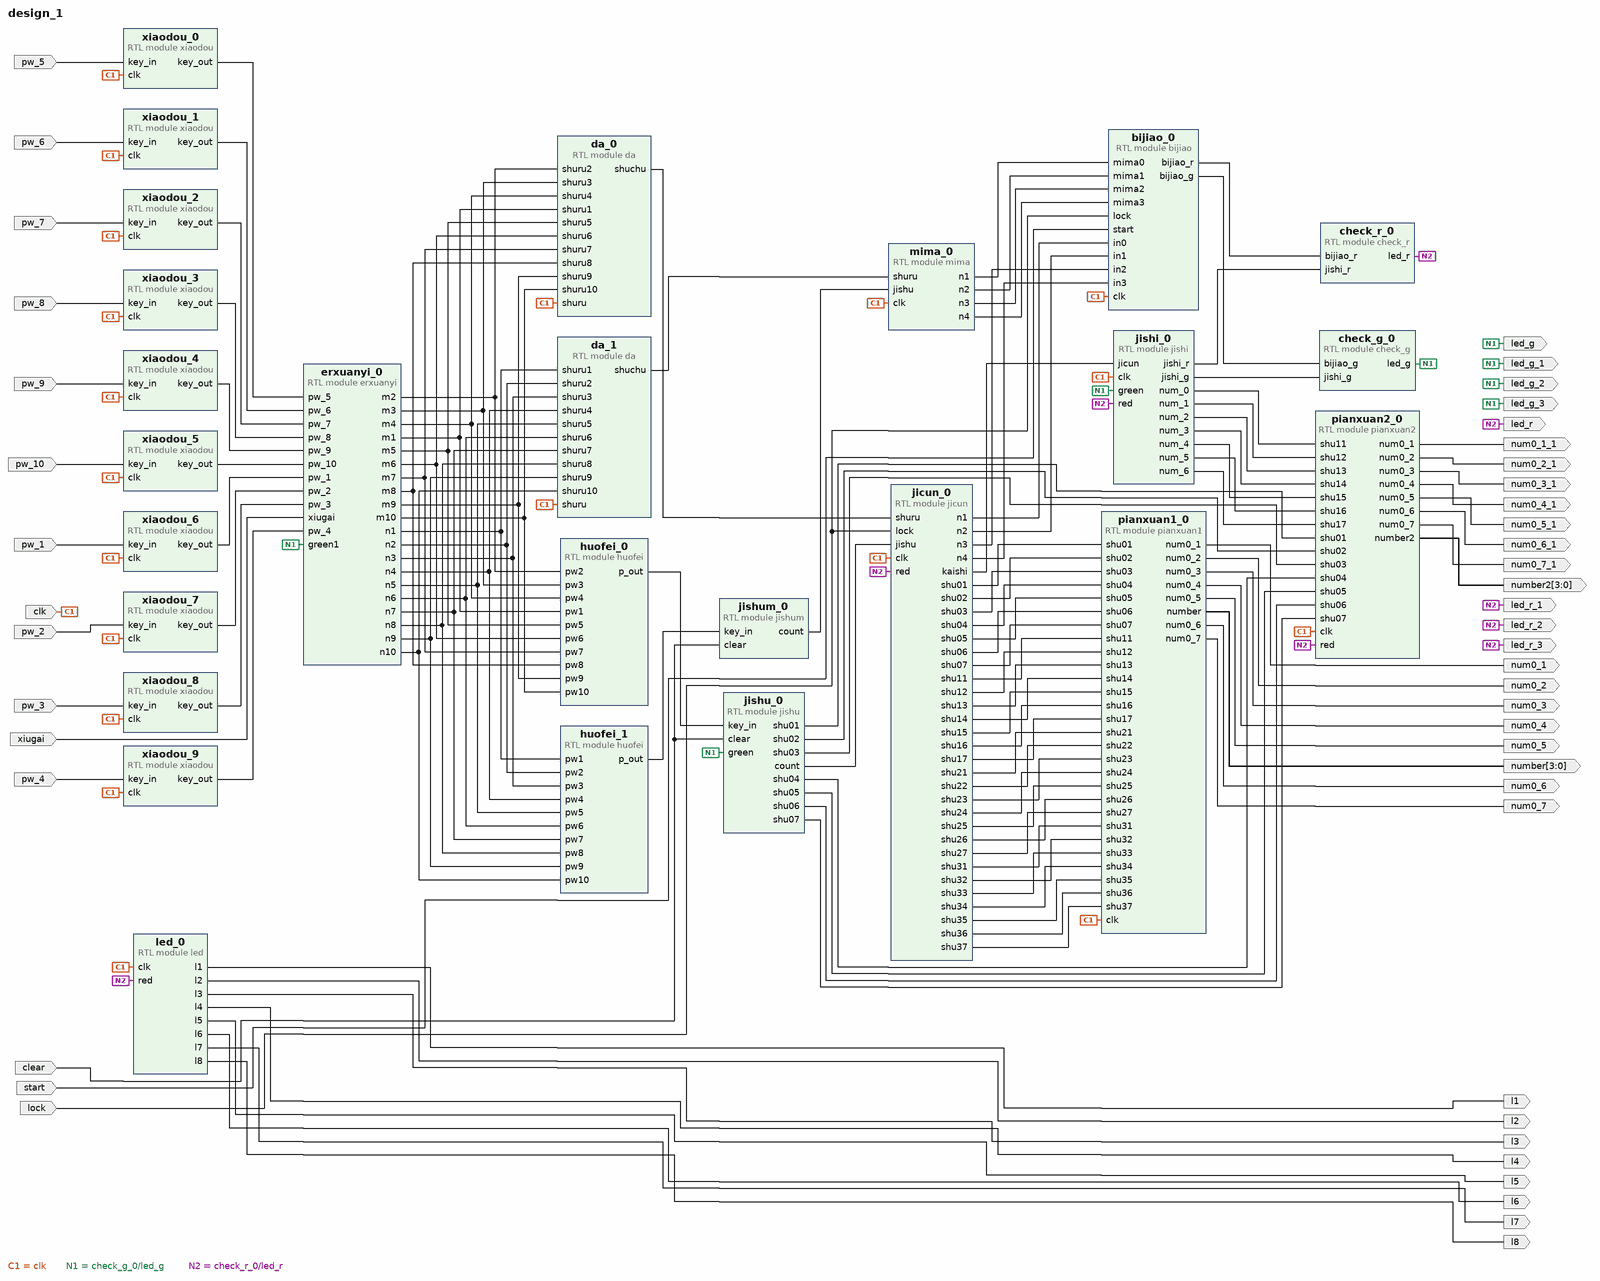
[diagram p0: block diagram of the top level]
# Vivado block design design_1, xc7a35tcsg324-3, Vivado 2017.4
create_bd_design design_1

create_bd_port -dir I pw_1
create_bd_port -dir I pw_2
create_bd_port -dir I pw_3
create_bd_port -dir I pw_4
create_bd_port -dir I xiugai
create_bd_port -dir I clear
create_bd_port -dir I -type clk clk
set_property -dict {CONFIG.FREQ_HZ 100000000} [get_bd_ports clk]
create_bd_port -dir I start
create_bd_port -dir I lock
create_bd_port -dir O led_g
create_bd_port -dir O led_g_1
create_bd_port -dir O led_g_2
create_bd_port -dir O led_g_3
create_bd_port -dir O led_r
create_bd_port -dir O led_r_1
create_bd_port -dir O led_r_2
create_bd_port -dir O led_r_3
create_bd_port -dir O -from 3 -to 0 number
create_bd_port -dir O num0_1
create_bd_port -dir O num0_2
create_bd_port -dir O num0_3
create_bd_port -dir O num0_4
create_bd_port -dir O num0_5
create_bd_port -dir O num0_6
create_bd_port -dir O num0_7
create_bd_port -dir O -from 3 -to 0 number2
create_bd_port -dir O num0_1_1
create_bd_port -dir O num0_2_1
create_bd_port -dir O num0_3_1
create_bd_port -dir O num0_4_1
create_bd_port -dir O num0_5_1
create_bd_port -dir O num0_6_1
create_bd_port -dir O num0_7_1
create_bd_port -dir O l1
create_bd_port -dir O l2
create_bd_port -dir O l3
create_bd_port -dir O l4
create_bd_port -dir O l5
create_bd_port -dir O l6
create_bd_port -dir O l7
create_bd_port -dir O l8
create_bd_port -dir I pw_5
create_bd_port -dir I pw_6
create_bd_port -dir I pw_7
create_bd_port -dir I pw_8
create_bd_port -dir I pw_9
create_bd_port -dir I pw_10

create_bd_cell -type module -reference jishum jishum_0
create_bd_cell -type module -reference check_g check_g_0
create_bd_cell -type module -reference check_r check_r_0
create_bd_cell -type module -reference pianxuan1 pianxuan1_0
create_bd_cell -type module -reference led led_0
create_bd_cell -type module -reference erxuanyi erxuanyi_0
create_bd_cell -type module -reference huofei huofei_0
create_bd_cell -type module -reference huofei huofei_1
create_bd_cell -type module -reference da da_0
create_bd_cell -type module -reference da da_1
create_bd_cell -type module -reference mima mima_0
create_bd_cell -type module -reference jishi jishi_0
create_bd_cell -type module -reference pianxuan2 pianxuan2_0
create_bd_cell -type module -reference bijiao bijiao_0
create_bd_cell -type module -reference jishu jishu_0
create_bd_cell -type module -reference jicun jicun_0
create_bd_cell -type module -reference xiaodou xiaodou_0
create_bd_cell -type module -reference xiaodou xiaodou_1
create_bd_cell -type module -reference xiaodou xiaodou_2
create_bd_cell -type module -reference xiaodou xiaodou_3
create_bd_cell -type module -reference xiaodou xiaodou_4
create_bd_cell -type module -reference xiaodou xiaodou_5
create_bd_cell -type module -reference xiaodou xiaodou_6
create_bd_cell -type module -reference xiaodou xiaodou_7
create_bd_cell -type module -reference xiaodou xiaodou_8
create_bd_cell -type module -reference xiaodou xiaodou_9

# ---- connections ----

connect_bd_net [get_bd_ports xiugai] [get_bd_pins erxuanyi_0/xiugai]
connect_bd_net [get_bd_pins erxuanyi_0/n1] [get_bd_pins huofei_1/pw1] [get_bd_pins da_1/shuru1]
connect_bd_net [get_bd_pins erxuanyi_0/n2] [get_bd_pins huofei_1/pw2] [get_bd_pins da_1/shuru2]
connect_bd_net [get_bd_pins erxuanyi_0/n3] [get_bd_pins huofei_1/pw3] [get_bd_pins da_1/shuru3]
connect_bd_net [get_bd_pins erxuanyi_0/n4] [get_bd_pins huofei_1/pw4] [get_bd_pins da_1/shuru4]
connect_bd_net [get_bd_pins erxuanyi_0/m2] [get_bd_pins huofei_0/pw2] [get_bd_pins da_0/shuru2]
connect_bd_net [get_bd_pins erxuanyi_0/m3] [get_bd_pins huofei_0/pw3] [get_bd_pins da_0/shuru3]
connect_bd_net [get_bd_pins erxuanyi_0/m4] [get_bd_pins huofei_0/pw4] [get_bd_pins da_0/shuru4]
connect_bd_net [get_bd_ports clear] [get_bd_pins jishum_0/clear] [get_bd_pins jishu_0/clear]
connect_bd_net [get_bd_pins huofei_0/p_out] [get_bd_pins jishu_0/key_in]
connect_bd_net [get_bd_pins erxuanyi_0/m1] [get_bd_pins huofei_0/pw1] [get_bd_pins da_0/shuru1]
connect_bd_net [get_bd_ports clk] \
  [get_bd_pins pianxuan1_0/clk] [get_bd_pins led_0/clk] [get_bd_pins da_0/shuru] [get_bd_pins da_1/shuru] \
  [get_bd_pins mima_0/clk] [get_bd_pins jishi_0/clk] [get_bd_pins pianxuan2_0/clk] [get_bd_pins bijiao_0/clk] \
  [get_bd_pins jicun_0/clk] [get_bd_pins xiaodou_0/clk] [get_bd_pins xiaodou_1/clk] [get_bd_pins xiaodou_2/clk] \
  [get_bd_pins xiaodou_3/clk] [get_bd_pins xiaodou_4/clk] [get_bd_pins xiaodou_5/clk] [get_bd_pins xiaodou_9/clk] \
  [get_bd_pins xiaodou_6/clk] [get_bd_pins xiaodou_7/clk] [get_bd_pins xiaodou_8/clk]
connect_bd_net [get_bd_pins da_0/shuchu] [get_bd_pins jicun_0/shuru]
connect_bd_net [get_bd_pins jishu_0/count] [get_bd_pins jicun_0/jishu]
connect_bd_net [get_bd_pins da_1/shuchu] [get_bd_pins mima_0/shuru]
connect_bd_net [get_bd_pins huofei_1/p_out] [get_bd_pins jishum_0/key_in]
connect_bd_net [get_bd_pins jishum_0/count] [get_bd_pins mima_0/jishu]
connect_bd_net [get_bd_pins mima_0/n1] [get_bd_pins bijiao_0/mima0]
connect_bd_net [get_bd_pins mima_0/n2] [get_bd_pins bijiao_0/mima1]
connect_bd_net [get_bd_pins mima_0/n3] [get_bd_pins bijiao_0/mima2]
connect_bd_net [get_bd_pins mima_0/n4] [get_bd_pins bijiao_0/mima3]
connect_bd_net [get_bd_pins jicun_0/n1] [get_bd_pins bijiao_0/in0]
connect_bd_net [get_bd_pins jicun_0/n2] [get_bd_pins bijiao_0/in1]
connect_bd_net [get_bd_pins jicun_0/n3] [get_bd_pins bijiao_0/in2]
connect_bd_net [get_bd_pins jicun_0/n4] [get_bd_pins bijiao_0/in3]
connect_bd_net [get_bd_ports start] [get_bd_pins bijiao_0/start]
connect_bd_net [get_bd_ports lock] [get_bd_pins bijiao_0/lock] [get_bd_pins jicun_0/lock]
connect_bd_net [get_bd_pins bijiao_0/bijiao_g] [get_bd_pins check_g_0/bijiao_g]
connect_bd_net [get_bd_pins bijiao_0/bijiao_r] [get_bd_pins check_r_0/bijiao_r]
connect_bd_net [get_bd_pins check_g_0/led_g] \
  [get_bd_ports led_g_3] [get_bd_ports led_g_2] [get_bd_ports led_g_1] [get_bd_ports led_g] [get_bd_pins erxuanyi_0/green1] \
  [get_bd_pins jishi_0/green] [get_bd_pins jishu_0/green]
connect_bd_net [get_bd_pins check_r_0/led_r] \
  [get_bd_ports led_r_3] [get_bd_ports led_r_2] [get_bd_ports led_r_1] [get_bd_ports led_r] [get_bd_pins led_0/red] \
  [get_bd_pins jishi_0/red] [get_bd_pins pianxuan2_0/red] [get_bd_pins jicun_0/red]
connect_bd_net [get_bd_pins jishi_0/jishi_g] [get_bd_pins check_g_0/jishi_g]
connect_bd_net [get_bd_pins jishi_0/jishi_r] [get_bd_pins check_r_0/jishi_r]
connect_bd_net -net jishu_0_kaishi [get_bd_pins jicun_0/kaishi] [get_bd_pins jishi_0/jicun]
connect_bd_net [get_bd_pins jicun_0/shu01] [get_bd_pins pianxuan1_0/shu01]
connect_bd_net [get_bd_pins jicun_0/shu02] [get_bd_pins pianxuan1_0/shu02]
connect_bd_net [get_bd_pins jicun_0/shu03] [get_bd_pins pianxuan1_0/shu03]
connect_bd_net [get_bd_pins jicun_0/shu04] [get_bd_pins pianxuan1_0/shu04]
connect_bd_net [get_bd_pins jicun_0/shu05] [get_bd_pins pianxuan1_0/shu05]
connect_bd_net [get_bd_pins jicun_0/shu06] [get_bd_pins pianxuan1_0/shu06]
connect_bd_net [get_bd_pins jicun_0/shu07] [get_bd_pins pianxuan1_0/shu07]
connect_bd_net [get_bd_pins jicun_0/shu11] [get_bd_pins pianxuan1_0/shu11]
connect_bd_net [get_bd_pins jicun_0/shu12] [get_bd_pins pianxuan1_0/shu12]
connect_bd_net [get_bd_pins jicun_0/shu13] [get_bd_pins pianxuan1_0/shu13]
connect_bd_net [get_bd_pins jicun_0/shu14] [get_bd_pins pianxuan1_0/shu14]
connect_bd_net [get_bd_pins jicun_0/shu15] [get_bd_pins pianxuan1_0/shu15]
connect_bd_net [get_bd_pins jicun_0/shu16] [get_bd_pins pianxuan1_0/shu16]
connect_bd_net [get_bd_pins jicun_0/shu17] [get_bd_pins pianxuan1_0/shu17]
connect_bd_net [get_bd_pins jicun_0/shu21] [get_bd_pins pianxuan1_0/shu21]
connect_bd_net [get_bd_pins jicun_0/shu22] [get_bd_pins pianxuan1_0/shu22]
connect_bd_net [get_bd_pins jicun_0/shu23] [get_bd_pins pianxuan1_0/shu23]
connect_bd_net [get_bd_pins jicun_0/shu24] [get_bd_pins pianxuan1_0/shu24]
connect_bd_net [get_bd_pins jicun_0/shu25] [get_bd_pins pianxuan1_0/shu25]
connect_bd_net [get_bd_pins jicun_0/shu26] [get_bd_pins pianxuan1_0/shu26]
connect_bd_net [get_bd_pins jicun_0/shu27] [get_bd_pins pianxuan1_0/shu27]
connect_bd_net [get_bd_pins jicun_0/shu31] [get_bd_pins pianxuan1_0/shu31]
connect_bd_net [get_bd_pins jicun_0/shu32] [get_bd_pins pianxuan1_0/shu32]
connect_bd_net [get_bd_pins jicun_0/shu33] [get_bd_pins pianxuan1_0/shu33]
connect_bd_net [get_bd_pins jicun_0/shu34] [get_bd_pins pianxuan1_0/shu34]
connect_bd_net [get_bd_pins jicun_0/shu35] [get_bd_pins pianxuan1_0/shu35]
connect_bd_net [get_bd_pins jicun_0/shu36] [get_bd_pins pianxuan1_0/shu36]
connect_bd_net [get_bd_pins jicun_0/shu37] [get_bd_pins pianxuan1_0/shu37]
connect_bd_net [get_bd_pins pianxuan1_0/number] [get_bd_ports number]
connect_bd_net [get_bd_pins pianxuan1_0/num0_1] [get_bd_ports num0_1]
connect_bd_net [get_bd_pins pianxuan1_0/num0_2] [get_bd_ports num0_2]
connect_bd_net [get_bd_pins pianxuan1_0/num0_3] [get_bd_ports num0_3]
connect_bd_net [get_bd_pins pianxuan1_0/num0_4] [get_bd_ports num0_4]
connect_bd_net [get_bd_pins pianxuan1_0/num0_5] [get_bd_ports num0_5]
connect_bd_net [get_bd_pins pianxuan1_0/num0_6] [get_bd_ports num0_6]
connect_bd_net [get_bd_pins pianxuan1_0/num0_7] [get_bd_ports num0_7]
connect_bd_net [get_bd_pins jishu_0/shu01] [get_bd_pins pianxuan2_0/shu01]
connect_bd_net [get_bd_pins jishu_0/shu02] [get_bd_pins pianxuan2_0/shu02]
connect_bd_net [get_bd_pins jishu_0/shu03] [get_bd_pins pianxuan2_0/shu03]
connect_bd_net [get_bd_pins jishu_0/shu04] [get_bd_pins pianxuan2_0/shu04]
connect_bd_net [get_bd_pins jishu_0/shu05] [get_bd_pins pianxuan2_0/shu05]
connect_bd_net [get_bd_pins jishu_0/shu06] [get_bd_pins pianxuan2_0/shu06]
connect_bd_net [get_bd_pins jishu_0/shu07] [get_bd_pins pianxuan2_0/shu07]
connect_bd_net [get_bd_pins jishi_0/num_0] [get_bd_pins pianxuan2_0/shu11]
connect_bd_net [get_bd_pins jishi_0/num_1] [get_bd_pins pianxuan2_0/shu12]
connect_bd_net [get_bd_pins jishi_0/num_2] [get_bd_pins pianxuan2_0/shu13]
connect_bd_net [get_bd_pins jishi_0/num_3] [get_bd_pins pianxuan2_0/shu14]
connect_bd_net [get_bd_pins jishi_0/num_4] [get_bd_pins pianxuan2_0/shu15]
connect_bd_net [get_bd_pins jishi_0/num_5] [get_bd_pins pianxuan2_0/shu16]
connect_bd_net [get_bd_pins jishi_0/num_6] [get_bd_pins pianxuan2_0/shu17]
connect_bd_net [get_bd_pins pianxuan2_0/number2] [get_bd_ports number2]
connect_bd_net [get_bd_pins pianxuan2_0/num0_1] [get_bd_ports num0_1_1]
connect_bd_net [get_bd_pins pianxuan2_0/num0_2] [get_bd_ports num0_2_1]
connect_bd_net [get_bd_pins pianxuan2_0/num0_3] [get_bd_ports num0_3_1]
connect_bd_net [get_bd_pins pianxuan2_0/num0_4] [get_bd_ports num0_4_1]
connect_bd_net [get_bd_pins pianxuan2_0/num0_5] [get_bd_ports num0_5_1]
connect_bd_net [get_bd_pins pianxuan2_0/num0_6] [get_bd_ports num0_6_1]
connect_bd_net [get_bd_pins pianxuan2_0/num0_7] [get_bd_ports num0_7_1]
connect_bd_net [get_bd_pins led_0/l1] [get_bd_ports l1]
connect_bd_net [get_bd_pins led_0/l2] [get_bd_ports l2]
connect_bd_net [get_bd_pins led_0/l3] [get_bd_ports l3]
connect_bd_net [get_bd_pins led_0/l4] [get_bd_ports l4]
connect_bd_net [get_bd_pins led_0/l5] [get_bd_ports l5]
connect_bd_net [get_bd_pins led_0/l6] [get_bd_ports l6]
connect_bd_net [get_bd_pins led_0/l7] [get_bd_ports l7]
connect_bd_net [get_bd_pins led_0/l8] [get_bd_ports l8]
connect_bd_net [get_bd_pins erxuanyi_0/n5] [get_bd_pins huofei_1/pw5] [get_bd_pins da_1/shuru5]
connect_bd_net [get_bd_pins erxuanyi_0/n6] [get_bd_pins huofei_1/pw6] [get_bd_pins da_1/shuru6]
connect_bd_net [get_bd_pins erxuanyi_0/n7] [get_bd_pins huofei_1/pw7] [get_bd_pins da_1/shuru7]
connect_bd_net [get_bd_pins erxuanyi_0/n8] [get_bd_pins huofei_1/pw8] [get_bd_pins da_1/shuru8]
connect_bd_net [get_bd_pins erxuanyi_0/n9] [get_bd_pins huofei_1/pw9] [get_bd_pins da_1/shuru9]
connect_bd_net [get_bd_pins erxuanyi_0/n10] [get_bd_pins huofei_1/pw10] [get_bd_pins da_1/shuru10]
connect_bd_net [get_bd_pins erxuanyi_0/m5] [get_bd_pins huofei_0/pw5] [get_bd_pins da_0/shuru5]
connect_bd_net [get_bd_pins erxuanyi_0/m6] [get_bd_pins huofei_0/pw6] [get_bd_pins da_0/shuru6]
connect_bd_net [get_bd_pins erxuanyi_0/m7] [get_bd_pins huofei_0/pw7] [get_bd_pins da_0/shuru7]
connect_bd_net [get_bd_pins erxuanyi_0/m8] [get_bd_pins huofei_0/pw8] [get_bd_pins da_0/shuru8]
connect_bd_net [get_bd_pins erxuanyi_0/m9] [get_bd_pins huofei_0/pw9] [get_bd_pins da_0/shuru9]
connect_bd_net [get_bd_pins erxuanyi_0/m10] [get_bd_pins huofei_0/pw10] [get_bd_pins da_0/shuru10]
connect_bd_net -net pw_5_1 [get_bd_ports pw_5] [get_bd_pins xiaodou_0/key_in]
connect_bd_net [get_bd_pins xiaodou_0/key_out] [get_bd_pins erxuanyi_0/pw_5]
connect_bd_net -net pw_6_1 [get_bd_ports pw_6] [get_bd_pins xiaodou_1/key_in]
connect_bd_net [get_bd_pins xiaodou_1/key_out] [get_bd_pins erxuanyi_0/pw_6]
connect_bd_net -net pw_7_1 [get_bd_ports pw_7] [get_bd_pins xiaodou_2/key_in]
connect_bd_net [get_bd_pins xiaodou_2/key_out] [get_bd_pins erxuanyi_0/pw_7]
connect_bd_net -net pw_8_1 [get_bd_ports pw_8] [get_bd_pins xiaodou_3/key_in]
connect_bd_net [get_bd_pins xiaodou_3/key_out] [get_bd_pins erxuanyi_0/pw_8]
connect_bd_net -net pw_9_1 [get_bd_ports pw_9] [get_bd_pins xiaodou_4/key_in]
connect_bd_net [get_bd_pins xiaodou_4/key_out] [get_bd_pins erxuanyi_0/pw_9]
connect_bd_net [get_bd_pins xiaodou_5/key_out] [get_bd_pins erxuanyi_0/pw_10]
connect_bd_net -net pw_10_1 [get_bd_ports pw_10] [get_bd_pins xiaodou_5/key_in]
connect_bd_net [get_bd_pins xiaodou_6/key_out] [get_bd_pins erxuanyi_0/pw_1]
connect_bd_net -net pw_1_1 [get_bd_ports pw_1] [get_bd_pins xiaodou_6/key_in]
connect_bd_net -net pw_2_1 [get_bd_ports pw_2] [get_bd_pins xiaodou_7/key_in]
connect_bd_net [get_bd_pins xiaodou_7/key_out] [get_bd_pins erxuanyi_0/pw_2]
connect_bd_net -net pw_3_1 [get_bd_ports pw_3] [get_bd_pins xiaodou_8/key_in]
connect_bd_net [get_bd_pins xiaodou_8/key_out] [get_bd_pins erxuanyi_0/pw_3]
connect_bd_net -net pw_4_1 [get_bd_ports pw_4] [get_bd_pins xiaodou_9/key_in]
connect_bd_net [get_bd_pins xiaodou_9/key_out] [get_bd_pins erxuanyi_0/pw_4]

validate_bd_design
save_bd_design
